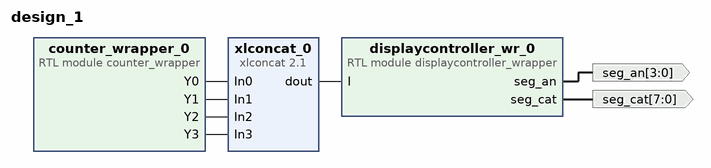
[diagram p0: block diagram of the top level]
# Vivado block design design_1, xc7z007sclg400-1, Vivado 2024.1.1
create_bd_design design_1

create_bd_port -dir O -from 3 -to 0 seg_an
create_bd_port -dir O -from 7 -to 0 seg_cat

create_bd_cell -type module -reference displaycontroller_wrapper displaycontroller_wr_0
create_bd_cell -type module -reference counter_wrapper counter_wrapper_0
create_bd_cell -type ip -vlnv xilinx.com:ip:xlconcat:2.1 xlconcat_0
set_property -dict [list \
  CONFIG.IN0_WIDTH 4 \
  CONFIG.IN1_WIDTH 4 \
  CONFIG.IN2_WIDTH 4 \
  CONFIG.IN3_WIDTH 4 \
  CONFIG.NUM_PORTS 4 \
] [get_bd_cells xlconcat_0]

# ---- connections ----

connect_bd_net [get_bd_pins counter_wrapper_0/Y0] [get_bd_pins xlconcat_0/In0]
connect_bd_net [get_bd_pins counter_wrapper_0/Y1] [get_bd_pins xlconcat_0/In1]
connect_bd_net [get_bd_pins counter_wrapper_0/Y2] [get_bd_pins xlconcat_0/In2]
connect_bd_net [get_bd_pins counter_wrapper_0/Y3] [get_bd_pins xlconcat_0/In3]
connect_bd_net [get_bd_pins displaycontroller_wr_0/seg_an] [get_bd_ports seg_an]
connect_bd_net [get_bd_pins displaycontroller_wr_0/seg_cat] [get_bd_ports seg_cat]
connect_bd_net [get_bd_pins xlconcat_0/dout] [get_bd_pins displaycontroller_wr_0/I]

validate_bd_design
save_bd_design
